# EAGLE design fonte (EAGLE 9.6.2)
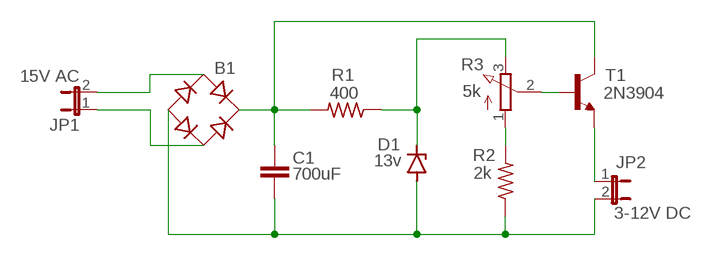
[diagram p0: schematic, sheet 1]

## Parts
B1  B-DIL  [B-DIL]
C1  700uF  C-EU025-025X050  [C025-025X050]
D1  13v  BZD23  [SOD81]
JP1  15V AC  JP1E  [JP1]
JP2  3-12V DC  JP1E  [JP1]
R1  400  R-US_0204/7  [0204/7]
R2  2k  R-US_0204/7  [0204/7]
R3  5k  3RP/1610N  [3RP/1610N]
T1  2N3904  [TO92]

## Nets
N$1: B1.AC1 JP1.2
N$2: B1.AC2 JP1.1
N$3: R3.2(S) T1.2(B)
N$4: B1.- C1.2 D1.A JP2.2 R2.1
N$5: R2.2 R3.1(A)
N$6: D1.C R1.1 R3.3(E)
N$7: JP2.1 T1.3(E)
N$8: B1.+ C1.1 R1.2 T1.1(C)

## Library data of the parts
B1 = rectifier:B-DIL: RECTIFIER
C1 = rcl:C-EU: CAPACITOR, European symbol; SPICEPREFIX: C
D1 = diode:BZD23: Z DIODE
JP1 JP2 = jumper:JP1E: JUMPER
R1 R2 = rcl:R-US_: RESISTOR, American symbol; SPICEPREFIX: R
R3 = pot:3RP/1610N: 16mm Potentiometer one level Source: http://www.alphapotentiometers.net/html/16mm_pot_2.html
T1 = transistor:2N3904: NPN TRANSISTOR

## Board
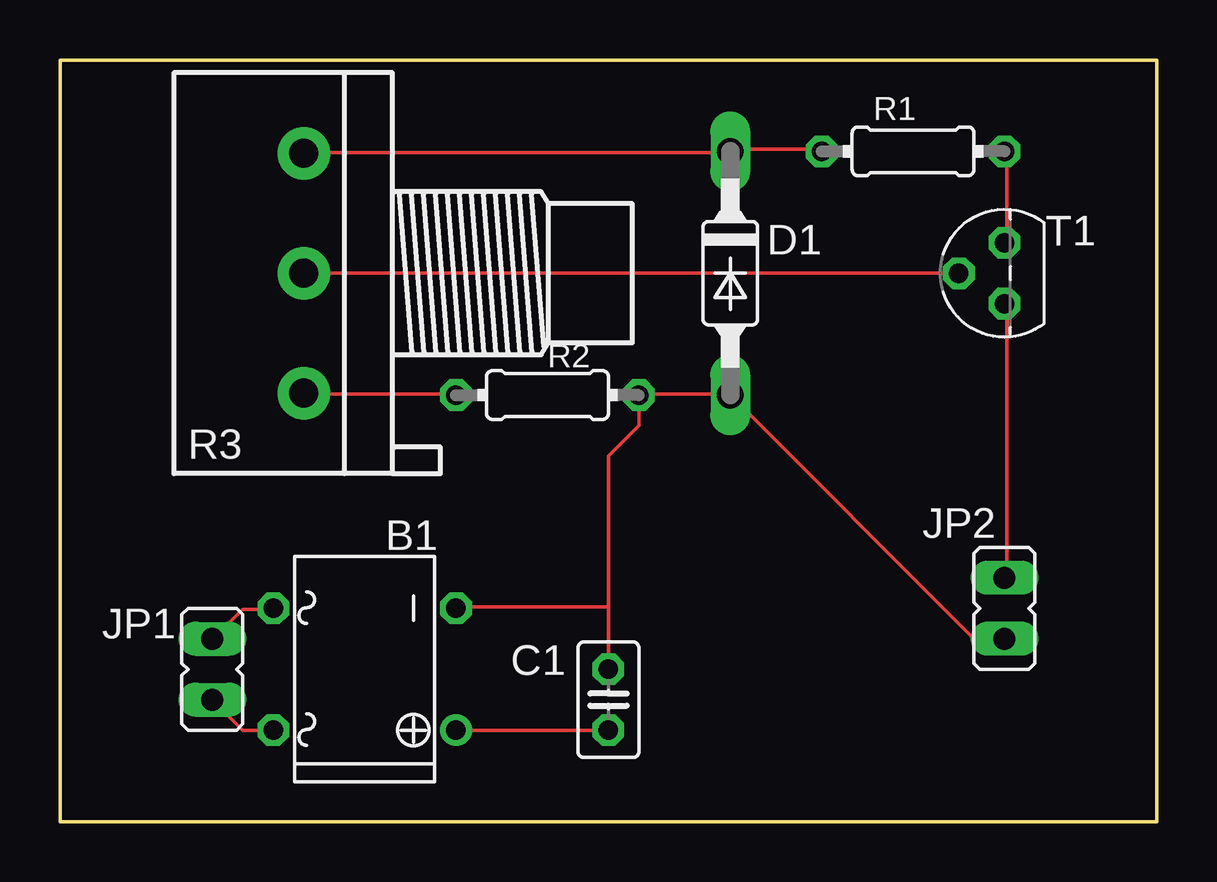
[diagram p1: board, top side]
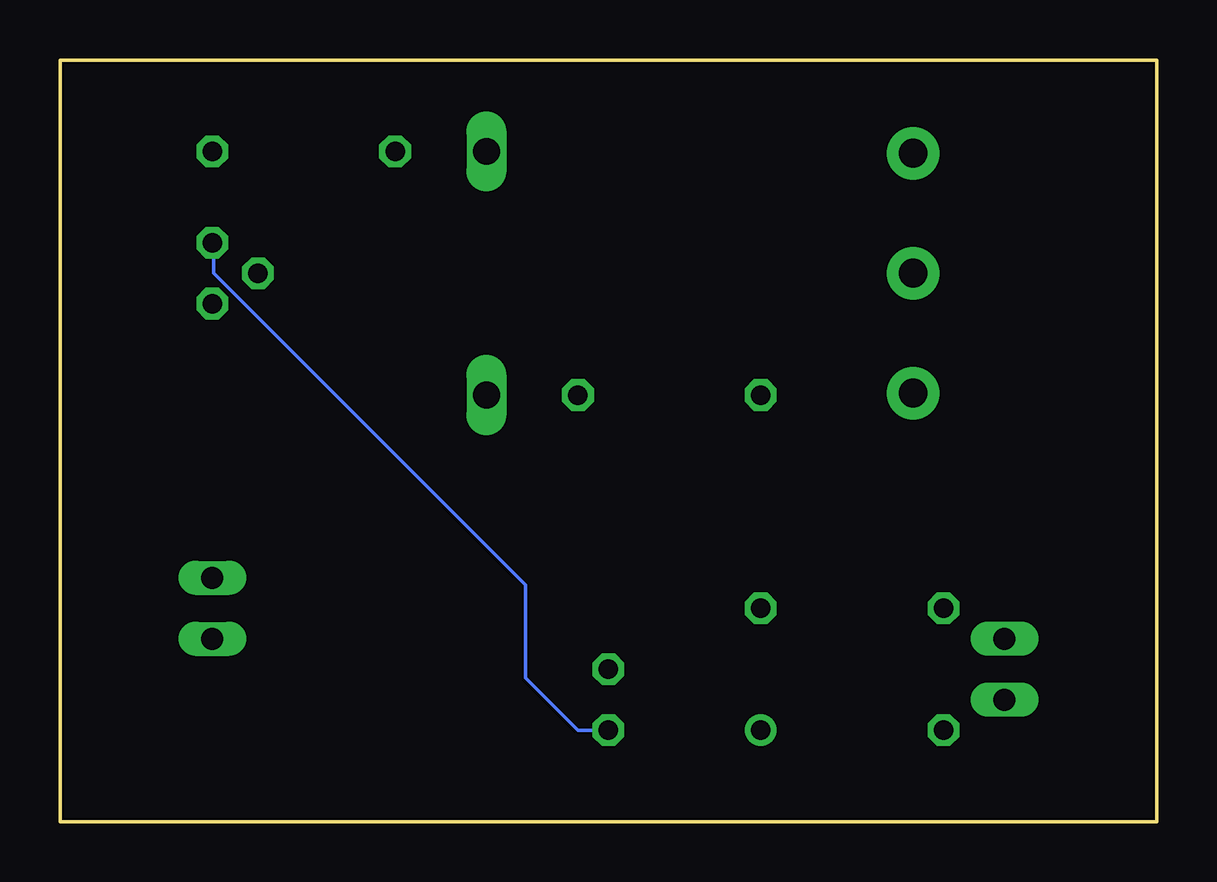
[diagram p2: board, bottom side, seen from below]

Size 45.72 x 31.75 mm. Coordinates in mm from the lower left corner, seen from the top.
Outline: 0,0 45.72,0 45.72,31.75 0,31.75 0,0
Copper layers (1*16): Top 0.035mm / dielectric 1.5mm / Bottom 0.035mm
Design rules "default": minimum track width 6mil, minimum drill 0.35mm, track to track 6mil, track to pad 6mil, pad to pad 6mil, via to via 6mil, smd to smd 6mil, copper to edge 40mil, drill to drill 6mil, minimum pad ring 10mil, minimum via ring 8mil, stop-mask expansion 4mil, vias tented up to drill 0mil, thermal gap 10mil

### Footprints (pad centres in the part's own frame; a part is rotated, then mirrored left to right if it is on the bottom)
B-DIL = drill 0.813: + -2.54,-3.81 | drill 0.813 octagon: - 2.54,-3.81; AC1 2.54,3.81; AC2 -2.54,3.81
C025-025X050 = drill 0.813 octagon: 1 -1.27,0; 2 1.27,0
SOD81 = drill 1.118 long: A 5.08,0; C -5.08,0
JP1 = drill 0.914 long: 1 0,-1.27; 2 0,1.27
0204/7 = drill 0.813 octagon: 1 -3.81,0; 2 3.81,0
3RP/1610N = drill 1.2 pad 2.184: 1 -5,0; 2 0,0; 3 5,0
TO92 = drill 0.813 octagon: 1 1.27,0; 2 0,1.905; 3 -1.27,0

### Placement (x,y rotation side)
B1  12.7,6.35 90 top
C1  22.86,5.08 90 top
D1  27.94,22.86 270 top
JP1  6.35,6.35 0 top
JP2  39.37,8.89 180 top
R1  35.56,27.94 0 top
R2  20.32,17.78 180 top
R3  10.16,22.86 90 top
T1  39.37,22.86 90 top

### Tracks (layer width: path | path; a pad name or v marks a point on that pad's centre or on a via)
N$1
  Top 0.152: B1.AC1 8.84,8.84 7.62,8.84 6.4,7.62 JP1.2
N$2
  Top 0.152: B1.AC2 7.62,3.81 JP1.1
N$3
  Top 0.152: R3.2 T1.2
N$4
  Top 0.152: 22.86,8.94 16.56,8.94 B1.- | 22.86,8.94 C1.2 | JP2.2 38.1,7.62 D1.A 27.89,17.83 24.18,17.83 R2.1 24.13,16.51 22.86,15.24 22.86,8.94
N$5
  Top 0.152: R3.1 10.21,17.83 16.46,17.83 R2.2
N$6
  Top 0.152: R1.1 31.7,28.04 28.04,28.04 D1.C 27.89,27.89 10.21,27.89 R3.3
N$7
  Top 0.152: T1.3 39.47,21.49 39.47,10.21 JP2.1
N$8
  Top 0.152: T1.1 39.47,24.23 39.47,27.89 R1.2 | C1.1 B1.+
  Bottom 0.152: C1.1 24.13,3.81 26.31,5.99 26.31,9.86 39.32,22.86 39.32,24.08 T1.1